# Altium schematic sheet zOld_SchematicComplet.SchDoc
size Letter
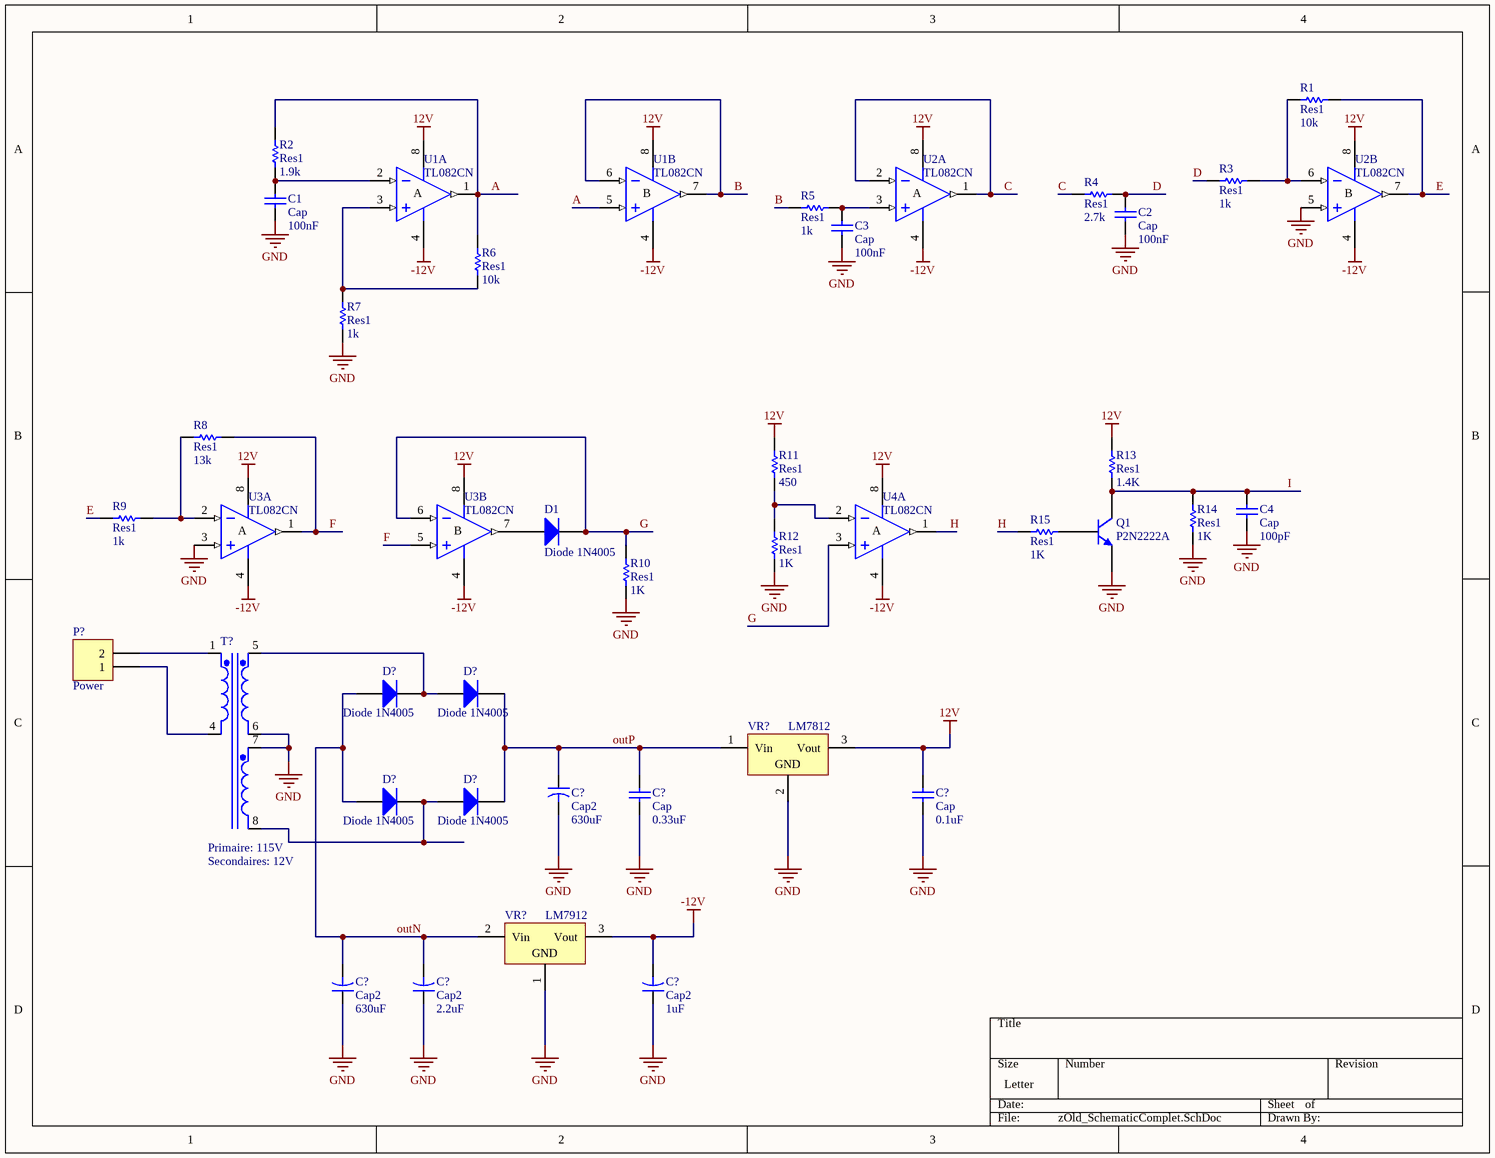
[diagram p0: zOld_SchematicComplet.SchDoc]

## Parts
(Parts that share a designator on the sheet are numbered #1, #2 ... from top to bottom, then left to right.)
C1  Cap  value 100nF  [RAD-0.3]
C2  Cap  value 100nF  [RAD-0.3]
C3  Cap  value 100nF  [RAD-0.3]
C4  Cap  value 100pF  [RAD-0.3]
C?#1  Cap2  value 630uF  [CAPR5-4X5]
C?#2  Cap  value 0.33uF  [RAD-0.3]
C?#3  Cap  value 0.1uF  [RAD-0.3]
C?#4  Cap2  value 630uF  [CAPR5-4X5]
C?#5  Cap2  value 2.2uF  [CAPR5-4X5]
C?#6  Cap2  value 1uF  [CAPR5-4X5]
D1  Diode 1N4005  [DO-41]
D?#1  Diode 1N4005  [DO-41]
D?#2  Diode 1N4005  [DO-41]
D?#3  Diode 1N4005  [DO-41]
D?#4  Diode 1N4005  [DO-41]
P?  Power  [HDR1X2]
Q1  P2N2222A  [29-04]
R1  Res1  value 10k  [AXIAL-0.3]
R2  Res1  value 1.9k  [AXIAL-0.3]
R3  Res1  value 1k  [AXIAL-0.3]
R4  Res1  value 2.7k  [AXIAL-0.3]
R5  Res1  value 1k  [AXIAL-0.3]
R6  Res1  value 10k  [AXIAL-0.3]
R7  Res1  value 1k  [AXIAL-0.3]
R8  Res1  value 13k  [AXIAL-0.3]
R9  Res1  value 1k  [AXIAL-0.3]
R10  Res1  value 1K  [AXIAL-0.3]
R11  Res1  value 450  [AXIAL-0.3]
R12  Res1  value 1K  [AXIAL-0.3]
R13  Res1  value 1.4K  [AXIAL-0.3]
R14  Res1  value 1K  [AXIAL-0.3]
R15  Res1  value 1K  [AXIAL-0.3]
T?  Primaire: 115V  Secondaires: 12V  [TRF_6]  (hidden comment: Trans3)
U1  TL082CN  [DIP8]  (parts A,B of 2)
U2  TL082CN  [DIP8]  (parts A,B of 2)
U3  TL082CN  [DIP8]  (parts A,B of 2)
U4  TL082CN  [DIP8]  (part A of 2)
VR?#1  LM7812  [D2PAK_N]
VR?#2  LM7912  [D2PAK_N]

## Nets
12V: C?#3.2 R11.2 R13.2 U1.8(V+) U2.8(V+) U3.8(V+) U4.8(V+) VR?#1.3(Vout)
-12V: C?#6.2 U1.4(V-) U2.4(V-) U3.4(V-) U4.4(V-) VR?#2.3(Vout)
GND: C1.1 C2.1 C3.1 C4.1 C?#1.2 C?#2.1 C?#3.1 C?#4.1 C?#5.1 C?#6.1 Q1.3(E) R7.1 R10.1 R12.1 R14.1 T?.6(Sec1-) T?.7(Sec2+) U2.5(IN+) U3.3(IN+) VR?#1.2(GND) VR?#2.1(GND)
A: R2.2 R6.2 U1.1(OUT) U1.5(IN+)
B: R5.1 U1.6(IN-) U1.7(OUT)
C: R4.1 U2.1(OUT) U2.2(IN-)
D: C2.2 R3.1 R4.2
E: R1.2 R9.1 U2.7(OUT)
F: R8.2 U3.1(OUT) U3.5(IN+)
G: D1.2(K) R10.2 U3.6(IN-) U4.3(IN+)
H: R15.2 U4.1(OUT)
I: C4.2 Q1.1(C) R13.1 R14.2
outN: C?#4.2 C?#5.2 D?#1.1(A) D?#3.1(A) VR?#2.2(Vin)
outP: C?#1.1 C?#2.2 D?#2.2(K) D?#4.2(K) VR?#1.1(Vin)
NetC1_2: C1.2 R2.1 U1.2(IN-)
NetC3_2: C3.2 R5.2 U2.3(IN+)
NetD1_1: D1.1(A) U3.7(OUT)
NetD?#1_2: D?#1.2(K) D?#2.1(A) T?.5(Sec1+)
NetD?#3_2: D?#3.2(K) D?#4.1(A) T?.8(Sec2-)
NetP?_1: P?.1 T?.4(Pri-)
NetP?_2: P?.2 T?.1(Pri+)
NetQ1_2: Q1.2(B) R15.1
NetR1_1: R1.1 R3.2 U2.6(IN-)
NetR6_1: R6.1 R7.2 U1.3(IN+)
NetR8_1: R8.1 R9.2 U3.2(IN-)
NetR11_1: R11.1 R12.2 U4.2(IN-)

## Notes on the sheet
- (in symbol TL082CN, part A) A
- (in symbol TL082CN, part B) B

## Library data of the parts
C1-C4 C?#2 C?#3 = Cap: Capacitor; Published: 8-Jun-2000; LatestRevisionDate: 17-Jul-2002; LatestRevisionNote: Re-released for DXP Platform.; PackageReference: RAD-0.3; Publisher: Altium Limited; PackageDescription: Radial Cap, Thru-Hole; 2 Leads; 0.3 in Pin Spacing
C?#1 C?#4-C?#6 = Cap2: Capacitor; Published: 23-Sep-2002; PackageReference: CAPR5-4X5; Publisher: Altium Limited; PackageDescription: Capacitor; 2 Leads
D1 D?#1-D?#4 = Diode 1N4005: 1 Amp General Purpose Rectifier; Published: 8-Jun-2000; LatestRevisionDate: 17-Jul-2002; LatestRevisionNote: Re-released for DXP Platform.; DatasheetVersion: 1998; PackageVersion: Aug-1999; PackageReference: DO-41; Publisher: Altium Limited; PackageDescription: Diode, Axial; Body 5.2 x 2.7 mm (LxDia. max), Lead Dia. 0.86 mm (max); Code_JEDEC: DO-204-AL; ComponentLink1Description: Manufacturer Link; ComponentLink1URL: http://www.fairchildsemi.com/; ComponentLink2Description: Datasheet; ComponentLink2URL: http://www.fairchildsemi.com/ds/1N%2F1N4001.pdf
P? = Header 2: Header, 2-Pin; LatestRevisionDate: 17-Jul-2002; LatestRevisionNote: Re-released for DXP Platform.; Publisher: Altium Limited
Q1 = P2N2222A: Amplifier Transistor NPN Silicon; Published: 29-Sep-2000; LatestRevisionDate: 17-Jul-2002; LatestRevisionNote: Re-released for DXP Platform.; DatasheetVersion: 1996; PackageVersion: 1996; PackageReference: 29-04; Publisher: Altium Limited; PackageDescription: TO, Flat Index; 3 In-Line, Axial Leads; Body Dia. 4.8mm; Leads 0.48 x 0.5 mm (max); ComponentLink1Description: Manufacturer Link; ComponentLink1URL: http://www.onsemi.com/site/products/landing?taxonomyID=194; ComponentLink2Description: Datasheet; ComponentLink2URL: http://www.onsemi.com/pub/Collateral/P2N2222A-D.PDF
R1-R15 = Res1: Resistor; Published: 8-Jun-2000; LatestRevisionDate: 17-Jul-2002; LatestRevisionNote: Re-released for DXP Platform.; PackageReference: AXIAL-0.3; Publisher: Altium Limited; PackageDescription: Axial Device, Thru-Hole; 2 Leads; 0.3 in Pin Spacing
T? = Trans3: Three-winding Transformer (Non-Ideal); Sim Note: Enter the turns ratios, Core loss resistance, Magnetising Reactance, Leakage Reactances and Resistances referred to the primary side into the parameter fields.; Published: 25-Jan-2001; LatestRevisionDate: 17-Jul-2002; LatestRevisionNote: Re-released for DXP Platform.; PackageReference: TRF_6; Publisher: Altium Limited; PackageDescription: Transformer; 6 Leads
U1-U4 = TL082CN: General-Purpose J-FET Dual Operational Amplifier; Published: 24-Aug-2001; LatestRevisionDate: 06-Jun-2005; LatestRevisionNote: Stylized 3D Model Added.; DatasheetVersion: Jan-1999; PackageReference: DIP8; Publisher: Altium Limited; PackageDescription: DIP; 8 Leads; Row Spacing 7.62 mm; Pitch 2.54 mm; Code_JEDEC: MO-001-AN; ComponentLink1Description: Manufacturer Link; ComponentLink1URL: http://www.st.com/; ComponentLink2Description: Datasheet; ComponentLink2URL: http://www.st.com/stonline/products/literature/ds/2300/tl082.pdf
VR?#1 VR?#2 = Volt Reg: Voltage Regulator; Published: 24-Mar-1999; LatestRevisionDate: 29-May-2009; LatestRevisionNote: IPC-7351 Footprint Added.; PackageReference: D2PAK; Publisher: Altium Limited; PackageDescription: 3-Pin Transistor Outline Package 2.54 mm Pitch, 15.1 mm Lead Span